# EAGLE design murdock_mcu_v2 (EAGLE 6.4)
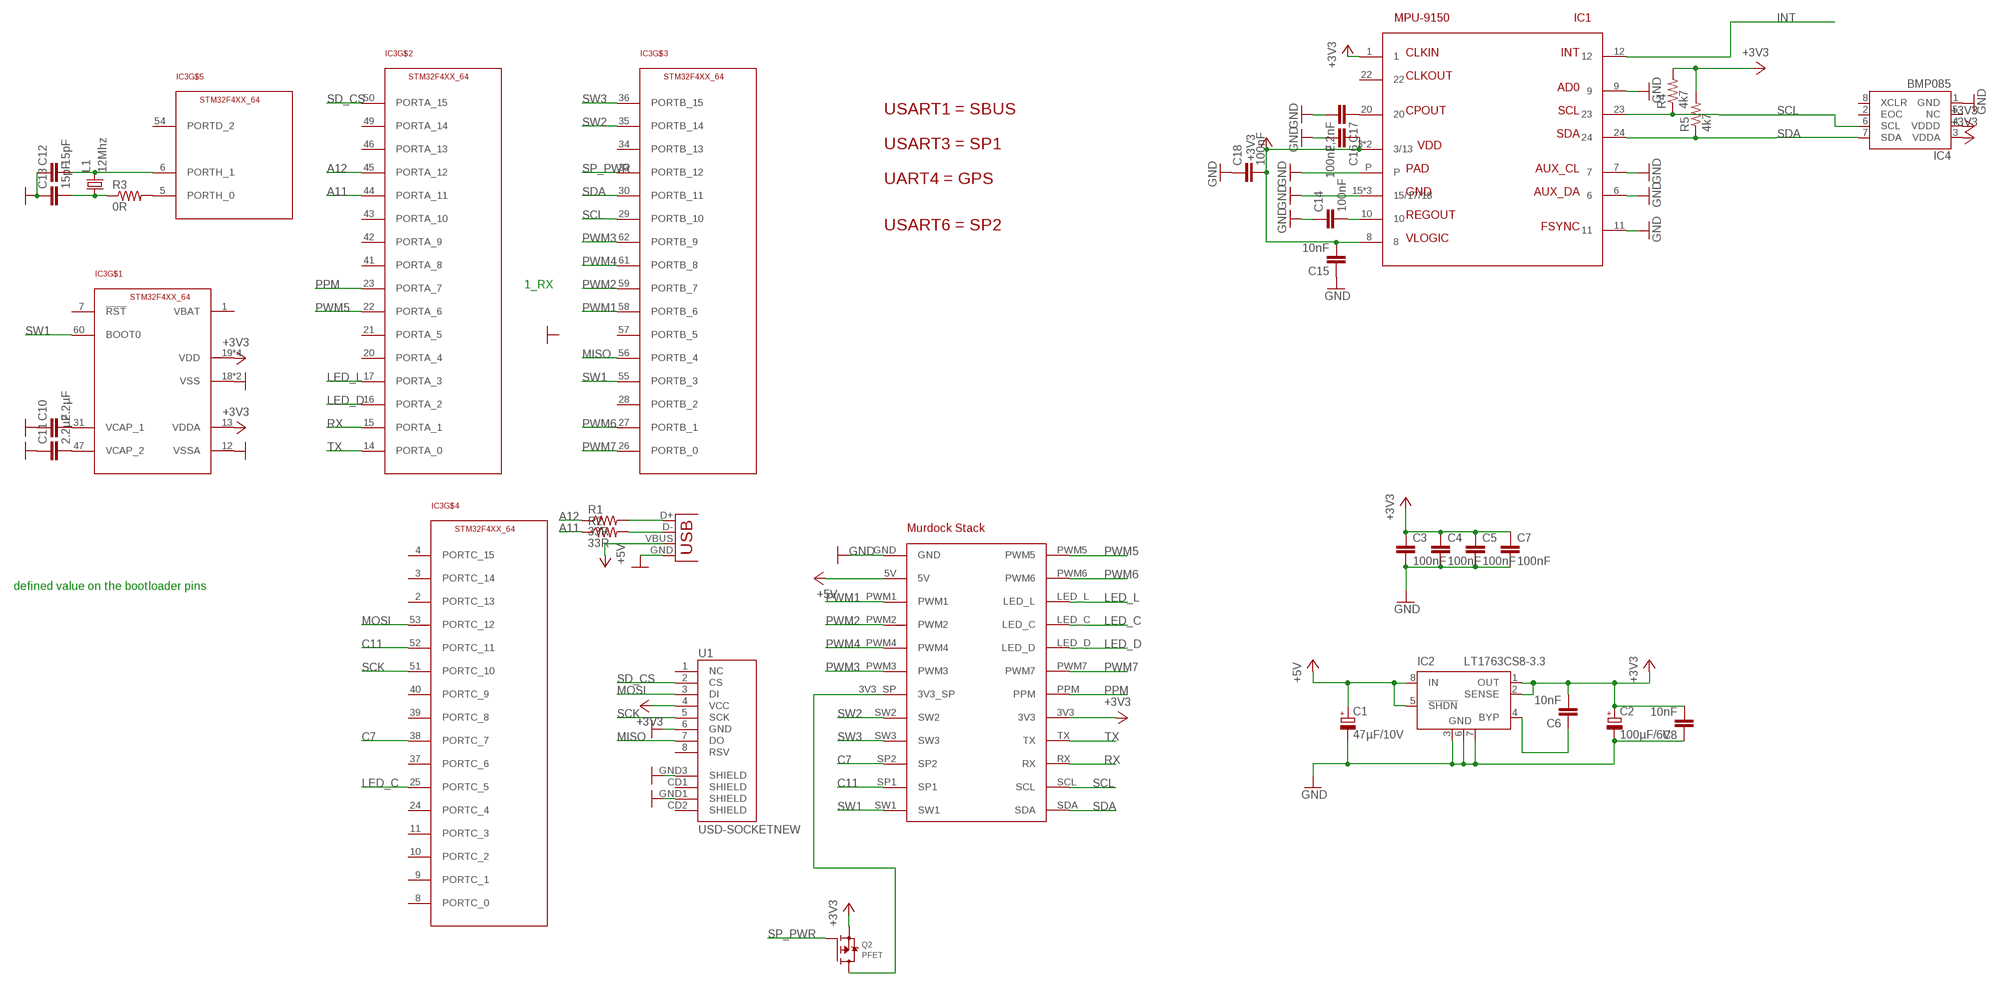
[diagram p0: schematic, sheet 1]

## Parts
C1  47µF/10V  CPOL-EUSMCD  [SMC_D]
C2  100µF/6V  CPOL-EUSMCD  [SMC_D]
C3  100nF  CAP0402-CAP  [0402-CAP]
C4  100nF  CAP0402-CAP  [0402-CAP]
C5  100nF  CAP0402-CAP  [0402-CAP]
C6  10nF  C-EUC0402  [C0402]
C7  100nF  CAP0402-CAP  [0402-CAP]
C8  10nF  C-EUC0402  [C0402]
C10  2.2µF  CAP0805  [0805]
C11  2.2µF  CAP0805  [0805]
C12  15pF  CAP0402-CAP  [0402-CAP]
C13  15pF  CAP0402-CAP  [0402-CAP]
C14  100nF  CAP0402-CAP  [0402-CAP]
C15  10nF  CAP0402-CAP  [0402-CAP]
C16  100nF  CAP0402-CAP  [0402-CAP]
C17  2,2nF  CAP0402-CAP  [0402-CAP]
C18  100nF  CAP0402-CAP  [0402-CAP]
IC1  MPU-9150  [QFN24]
IC2  LT1763CS8-3.3  [SOIC8]
IC3  STM32F4XX_64  [TQFP64]
IC4  BMP085  [BMP085]
L1  12Mhz  X22-OSCILLATOR  [X22]
Q2  PFET  MOSFET-P  [SOT23-R]
R1  33R  RESISTOR0402-RES  [0402-RES]
R2  33R  RESISTOR0402-RES  [0402-RES]
R3  0R  RESISTOR0402-RES  [0402-RES]
R4  4k7  RESISTOR0402-RES  [0402-RES]
R5  4k7  RESISTOR0402-RES  [0402-RES]
U1  USD-SOCKETNEW  [MICRO-SD-SOCKET-PP]
X1  USBSMD  [USB-MINIB]
X2  MURDOCK_STACK  [MURDOCK_STACK]

## Nets
+3V3: C2.+ C3.1 C4.1 C5.1 C6.2 C7.1 C8.2 C15.2 C16.1 C18.2 IC1.1 IC1.3(3/13) IC1.8 IC1.13(3/13) IC2.1(OUT) IC2.2(SENSE) IC3.13(VDDA) IC3.19(VDD) IC3.32(VDD) IC3.48(VDD) IC3.64(VDD) IC4.3(VDDA) IC4.4(VDDD) Q2.2(S) R4.2 R5.2 U1.4(VCC) X2.3V3
+5V: C1.+ IC2.5(!SHDN) IC2.8(IN) X1.VBUS X2.5V
A11: IC3.44(PORTA_11) R2.1
A12: IC3.45(PORTA_12) R1.1
C7: IC3.38(PORTC_7) X2.SP2
C11: IC3.52(PORTC_11) X2.SP1
GND: C1.- C2.- C3.2 C4.2 C5.2 C7.2 C8.1 C10.1 C11.1 C12.1 C13.1 C14.1 C15.1 C16.2 C17.2 C18.1 IC1.6 IC1.7 IC1.9 IC1.11 IC1.15(15/17/18) IC1.17(15/17/18) IC1.18(15/17/18) IC1.P IC2.3(GND) IC2.6(GND) IC2.7(GND) IC3.12(VSSA) IC3.18(VSS) IC3.63(VSS) IC4.1(GND) U1.6(GND) U1.GND1(SHIELD) U1.GND3(SHIELD) X1.GND X2.GND
INT: IC1.12
LED_C: IC3.25(PORTC_5) X2.LED_C
LED_D: IC3.16(PORTA_2) X2.LED_D
LED_L: IC3.17(PORTA_3) X2.LED_L
MISO: IC3.56(PORTB_4) U1.7(DO)
MOSI: IC3.53(PORTC_12) U1.3(DI)
N$1: R2.2 X1.D-
N$2: R1.2 X1.D+
N$3: C10.2 IC3.31(VCAP_1)
N$4: C11.2 IC3.47(VCAP_2)
N$5: IC3.5(PORTH_0) R3.2
N$6: C13.2 L1.1 R3.1
N$7: C12.2 IC3.6(PORTH_1) L1.3
N$8: Q2.3(D) X2.3V3_SP
N$9: C14.2 IC1.10
N$10: C17.1 IC1.20
N$13: C6.1 IC2.4(BYP)
PPM: IC3.23(PORTA_7) X2.PPM
PWM1: IC3.58(PORTB_6) X2.PWM1
PWM2: IC3.59(PORTB_7) X2.PWM2
PWM3: IC3.62(PORTB_9) X2.PWM3
PWM4: IC3.61(PORTB_8) X2.PWM4
PWM5: IC3.22(PORTA_6) X2.PWM5
PWM6: IC3.27(PORTB_1) X2.PWM6
PWM7: IC3.26(PORTB_0) X2.PWM7
RX: IC3.15(PORTA_1) X2.RX
SCK: IC3.51(PORTC_10) U1.5(SCK)
SCL: IC1.23 IC3.29(PORTB_10) IC4.6(SCL) R4.1 X2.SCL
SD_CS: IC3.50(PORTA_15) U1.2(CS)
SDA: IC1.24 IC3.30(PORTB_11) IC4.7(SDA) R5.1 X2.SDA
SP_PWR: IC3.33(PORTB_12) Q2.1(G)
SW1: IC3.55(PORTB_3) IC3.60(BOOT0) X2.SW1
SW2: IC3.35(PORTB_14) X2.SW2
SW3: IC3.36(PORTB_15) X2.SW3
TX: IC3.14(PORTA_0) X2.TX
Unconnected: IC1.22 IC3.1(VBAT) IC3.2(PORTC_13) IC3.3(PORTC_14) IC3.4(PORTC_15) IC3.7(!RST) IC3.8(PORTC_0) IC3.9(PORTC_1) IC3.10(PORTC_2) IC3.11(PORTC_3) IC3.20(PORTA_4) IC3.21(PORTA_5) IC3.24(PORTC_4) IC3.28(PORTB_2) IC3.34(PORTB_13) IC3.37(PORTC_6) IC3.39(PORTC_8) IC3.40(PORTC_9) IC3.41(PORTA_8) IC3.42(PORTA_9) IC3.43(PORTA_10) IC3.46(PORTA_13) IC3.49(PORTA_14) IC3.54(PORTD_2) IC3.57(PORTB_5) IC4.2(EOC) IC4.5(NC) IC4.8(XCLR) U1.1(NC) U1.8(RSV) U1.CD1(SHIELD) U1.CD2(SHIELD)

## Notes on the sheet
- USART1 = SBUS
- USART3 = SP1
- UART4 = GPS
- USART6 = SP2
- 1_RX
- defined value on the bootloader pins

## Library data of the parts
C1 C2 = rcl:CPOL-EU: POLARIZED CAPACITOR, European symbol
C3-C5 C7 C10-C13 = SparkFun-Capacitors:CAP: Capacitor Standard 0603 ceramic capacitor, and 0.1" leaded capacitor.
C6 C8 = rcl:C-EU: CAPACITOR, European symbol
C14-C18 = SparkFun:CAP: Capacitor Standard 0603 ceramic capacitor, and 0.1" leaded capacitor.
IC1 = seb:MPU-9150
IC2 = linear-technology:LT1763CS8: 500mA, Low Noise, LDO Micropower Regulators Source: http://cds.linear.com/docs/Datasheet/1763ff.pdf; MPN: LT1763CS8-3.3; OC_FARNELL: 1273617; OC_NEWARK: 57M6055
IC3 = stm32:STM32F4XX_64
IC4 = SparkFun-Sensors:BMP085: BMP085 Pressure Sensor Great little MEMS pressure sensor. SKU: COM-09603
L1 = seb:X22-OSCILLATOR
Q2 = microbuilder:MOSFET-P: P-Channel Mosfet LEGEND VDS: Voltage Drain-Source ID: Drain Current RDS(ON): Drain-Source On-State Resistance VGS(TH): Gate-Source Threshold Voltage CISS: Drain-Source Input Capacitance SOT-23 Name VDS ID RDS(ON) VGS(TH) CISS Order Number IRLML5103 30V 760mA 600 mOhm -- 75pF @ 25V Digikey: IRLML5103PBFCT-ND IRLML6401 12V 4.3A 50 mOhm 950mV @ 250µA 830pF @ 10V Digikey: IRLML6401PBFTR-ND NTR0202PL 20V 400mA 800 mOhm 2.3V @ 250uA 70pF @ 5V Digikey: NTR0202PLT1GOSTR-ND NTR4101PT1G 20V 1.8A 85 mOhm 1.2V @ 250uA 675pF @ 10V Digikey: NTR4101PT1GOSCT-ND DMP2004K 20V 600mA 900 mOhm 1V @ 250uA 175pF @ 16V Digikey: DMP2004KDICT-ND PMV65XP 20V 3.9A 76 mOhm 950mV @ 1mA 725pF @ 20V Digikey: 568-2358-2-ND TO-252 Name VDS ID RDS(ON) VGS(TH) CISS Order Number AOD417 30V 25A 34 mOhm 3V @ 250µA 920pF @ 15V Digikey: 785-1106-2-ND
R1-R3 = SparkFun-Resistors:RESISTOR: Resistor
R4 R5 = SparkFun:RESISTOR: Resistor
U1 = SparkFun-Connectors:USD-SOCKET: microSD Socket Push-push type uSD socket. Schematic element and footprint production proven. Spark Fun Electronics SKU : PRT-00127. tDoc lines correctly indicate media card edge positions when inserting (unlocked, locked, depressed).
X1 = SparkFun-Connectors:USB: USB Connectors USB-B-PTH is fully proven SKU : PRT-00139 USB-miniB is fully proven SKU : PRT-00587 USB-A-PCB is untested. USB-A-H is throughly reviewed, but untested. Spark Fun Electronics SKU : PRT-00437 USB-B-SMT is throughly reviewed, but untested. Needs silkscreen touching up. USB-A-S has not been used/tested USB-MB-H has not been used/tested
X2 = murdock:MURDOCK_STACK

## Board
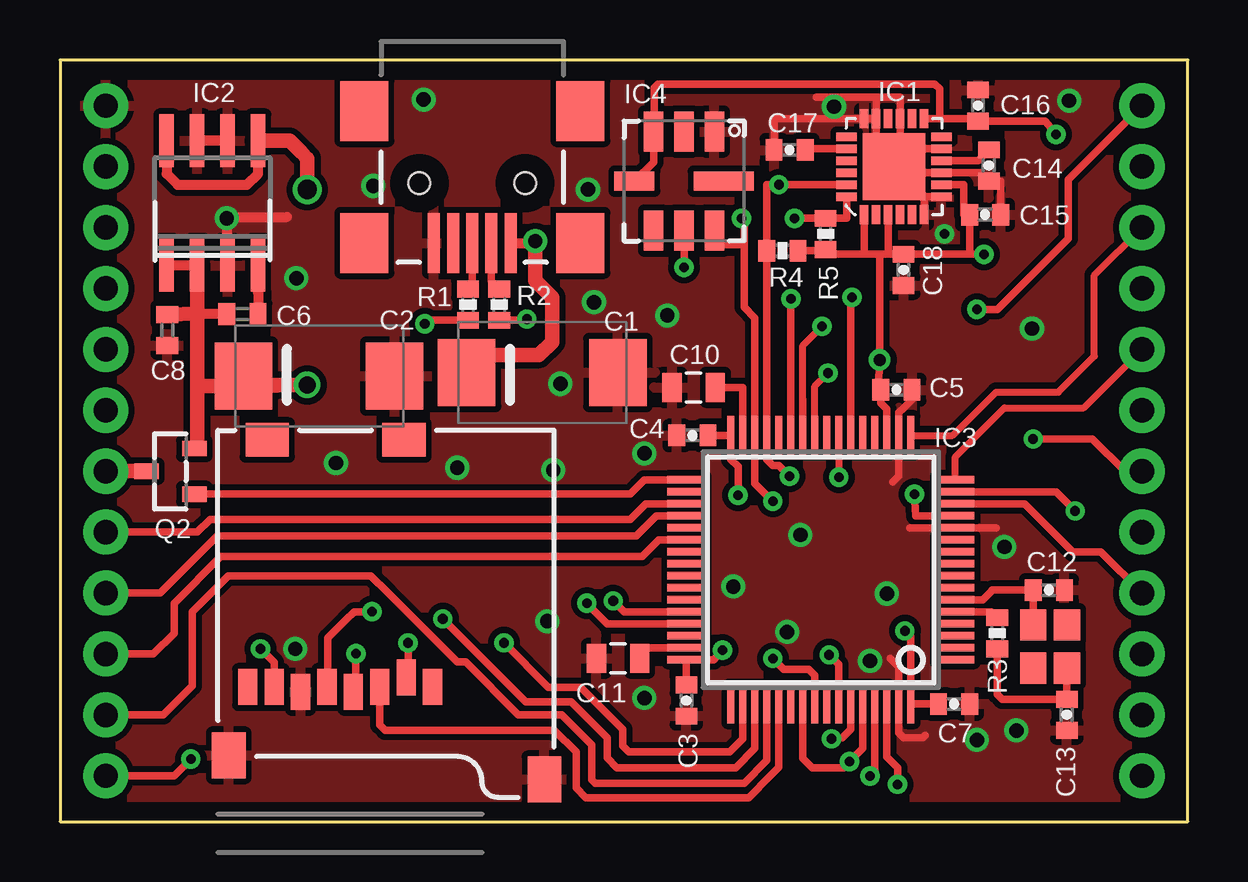
[diagram p1: board, top side]
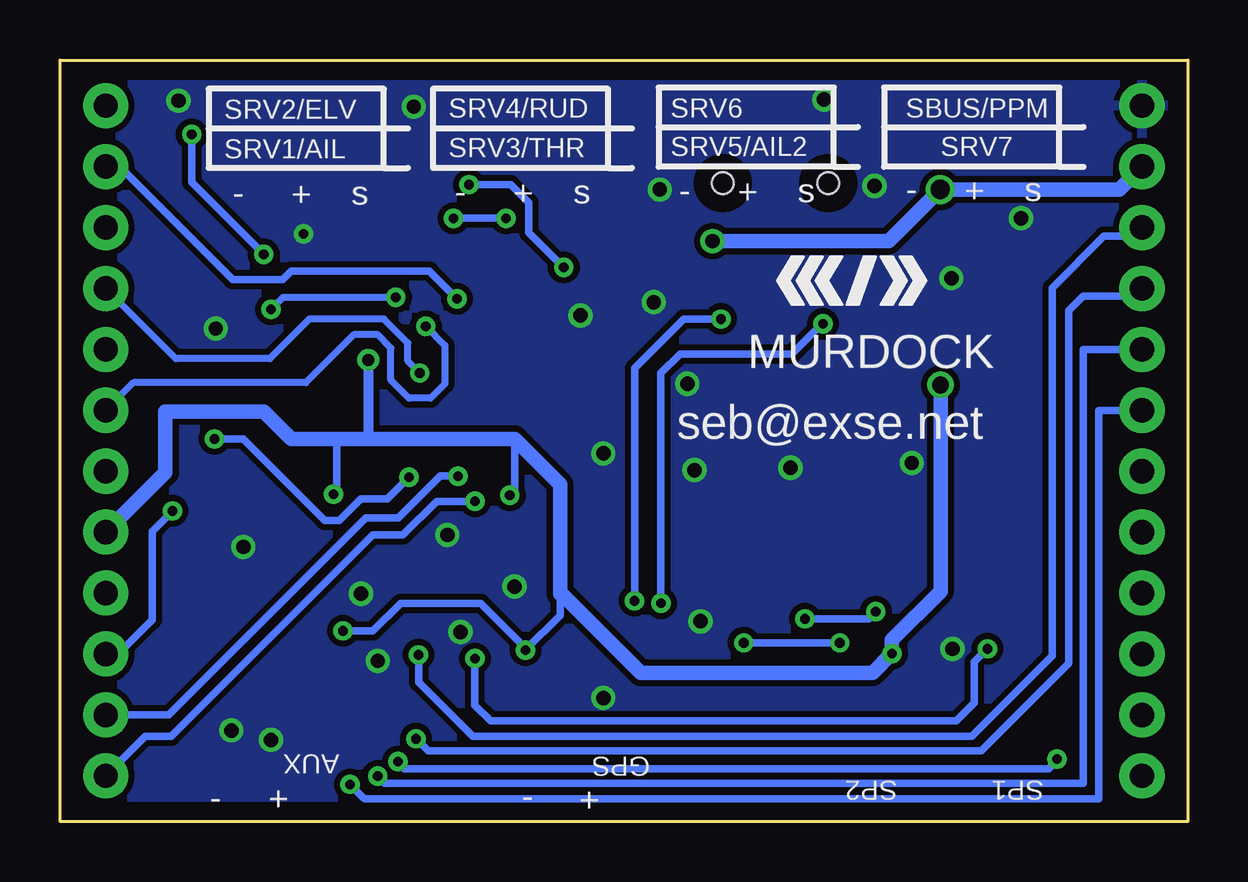
[diagram p2: board, bottom side, seen from below]

Size 46.99 x 31.75 mm. Coordinates in mm from the lower left corner, seen from the top.
Copper layers (1*16): Top 0.035mm / dielectric 1.5mm / Bottom 0.035mm
Design rules "default": minimum track width 10mil, minimum drill 0.4mm, track to track 8mil, track to pad 8mil, pad to pad 8mil, via to via 8mil, smd to smd 8mil, copper to edge 30mil, drill to drill 8mil, minimum pad ring 10mil, minimum via ring 8mil, stop-mask expansion 4mil, vias tented up to drill 1.5mm, thermal gap 10mil

### Footprints (pad centres in the part's own frame; a part is rotated, then mirrored left to right if it is on the bottom)
SMC_D = smd 2.4 x 2.8: + -3.15,0; - 3.15,0
0402-CAP = smd 0.7 x 0.9: 1 -0.65,0; 2 0.65,0
C0402 = smd 0.7 x 0.9: 1 -0.65,0; 2 0.65,0
0805 = smd 0.8 x 1.2: 1 -0.9,0; 2 0.9,0
QFN24 = smd 0.8 x 0.35: 1 -2,1.25; 2 -2,0.75; 3 -2,0.25; 4 -2,-0.25; 5 -2,-0.75; 6 -2,-1.25; 13 2,-1.25; 14 2,-0.75; 15 2,-0.25; 16 2,0.25; 17 2,0.75; 18 2,1.25 | smd 0.35 x 0.85: 7 -1.25,-1.975; 8 -0.75,-1.975; 9 -0.25,-1.975; 10 0.25,-1.975; 11 0.75,-1.975; 12 1.25,-1.975; 19 1.25,1.975; 20 0.75,1.975; 21 0.25,1.975; 22 -0.25,1.975; 23 -0.75,1.975; 24 -1.25,1.975 | smd 2.8 x 2.6: P 0,0
SOIC8 = smd 0.6 x 2.2: 1 -1.905,-2.6; 2 -0.635,-2.6; 3 0.635,-2.6; 4 1.905,-2.6; 5 1.905,2.6; 6 0.635,2.6; 7 -0.635,2.6; 8 -1.905,2.6
TQFP64 = smd 0.3 x 1.6: 1 -3.75,-5.6; 2 -3.25,-5.6; 3 -2.75,-5.6; 4 -2.25,-5.6; 5 -1.75,-5.6; 6 -1.25,-5.6; 7 -0.75,-5.6; 8 -0.25,-5.6; 9 0.25,-5.6; 10 0.75,-5.6; 11 1.25,-5.6; 12 1.75,-5.6; 13 2.25,-5.6; 14 2.75,-5.6; 15 3.25,-5.6; 16 3.75,-5.6; 33 3.75,5.6; 34 3.25,5.6; 35 2.75,5.6; 36 2.25,5.6; 37 1.75,5.6; 38 1.25,5.6; 39 0.75,5.6; 40 0.25,5.6; 41 -0.25,5.6; 42 -0.75,5.6; 43 -1.25,5.6; 44 -1.75,5.6; 45 -2.25,5.6; 46 -2.75,5.6; 47 -3.25,5.6; 48 -3.75,5.6 | smd 1.6 x 0.3: 17 5.6,-3.75; 18 5.6,-3.25; 19 5.6,-2.75; 20 5.6,-2.25; 21 5.6,-1.75; 22 5.6,-1.25; 23 5.6,-0.75; 24 5.6,-0.25; 25 5.6,0.25; 26 5.6,0.75; 27 5.6,1.25; 28 5.6,1.75; 29 5.6,2.25; 30 5.6,2.75; 31 5.6,3.25; 32 5.6,3.75; 49 -5.6,3.75; 50 -5.6,3.25; 51 -5.6,2.75; 52 -5.6,2.25; 53 -5.6,1.75; 54 -5.6,1.25; 55 -5.6,0.75; 56 -5.6,0.25; 57 -5.6,-0.25; 58 -5.6,-0.75; 59 -5.6,-1.25; 60 -5.6,-1.75; 61 -5.6,-2.25; 62 -5.6,-2.75; 63 -5.6,-3.25; 64 -5.6,-3.75
BMP085 = smd 1.67 x 0.8: 1 -2.065,1.27; 2 -2.065,0; 3 -2.065,-1.27; 5 2.065,-1.27; 6 2.065,0; 7 2.065,1.27 | smd 0.8 x 1.67: 4 0,-2.065 | smd 0.8 x 2.5: 8 0,1.65
X22 = smd 1.3 x 1.1: 1 0.9,0.7; 2 -0.9,0.7; 3 -0.9,-0.7; 4 0.9,-0.7
SOT23-R = smd 0.635 x 1.016: 1 -0.95,-1; 2 0.95,-1; 3 0,1
0402-RES = smd 0.7 x 0.9: 1 -0.65,0; 2 0.65,0
MICRO-SD-SOCKET-PP = smd 0.8 x 1.5: 1 -8.94,10.7; 2 -7.84,10.3; 3 -6.74,10.7; 4 -5.64,10.9; 5 -4.54,10.7; 6 -3.44,10.9; 7 -2.34,10.7; 8 -1.24,10.7 | smd 1.8 x 1.4: CD1 -2.05,0.4; CD2 -7.75,0.4 | smd 1.4 x 1.9: GND1 -13.6,14.55; GND3 -0.45,13.55
USB-MINIB = smd 2.5 x 0.5: D+ 2.5,0; D- 2.5,0.8; GND 2.5,-1.6; ID 2.5,-0.8; VBUS 2.5,1.6 | smd 2.5 x 2: MTN1 -3,4.5; MTN2 2.5,4.5; MTN3 -3,-4.5; MTN4 2.5,-4.5 | hole 0.9: 0,2.2; 0,-2.2
MURDOCK_STACK = drill 1.016 pad 1.88: 3V3 45.085,12.065; 3V3_SP 1.905,14.605; 5V 1.905,27.305; GND 1.905,29.845; LED_C 45.085,22.225; LED_D 45.085,19.685; LED_L 45.085,24.765; PPM 45.085,14.605; PWM1 1.905,24.765; PWM2 1.905,22.225; PWM3 1.905,17.145; PWM4 1.905,19.685; PWM5 45.085,29.845; PWM6 45.085,27.305; PWM7 45.085,17.145; RX 45.085,6.985; SCL 45.085,4.445; SDA 45.085,1.905; SP1 1.905,4.445; SP2 1.905,6.985; SW1 1.905,1.905; SW2 1.905,12.065; SW3 1.905,9.525; TX 45.085,9.525

### Placement (x,y rotation side)
C1  [SMC_D]  20.09,18.72 0 top
C2  [SMC_D]  10.79,18.57 0 top
C3  [0402-CAP]  26.1,5.05 270 top
C4  [0402-CAP]  26.35,16.1 180 top
C5  [0402-CAP]  34.85,18 0 top
C6  7.6,21.16 180 top
C7  [0402-CAP]  37.25,4.9 0 top
C8  4.47,20.49 90 top
C10  [0805]  26.4,18.1 0 top
C11  [0805]  23.25,6.8 0 top
C12  [0402-CAP]  41.2,9.65 180 top
C13  [0402-CAP]  41.95,4.45 90 top
C14  38.7,27.35 90 top
C15  38.55,25.3 180 top
C16  38.25,29.85 90 top
C17  30.4,28 180 top
C18  35.15,23 90 top
IC1  34.75,27.3 90 top
IC2  6.35,25.79 0 top
IC3  31.7,10.5 90 top
IC4  26,26.7 270 top
L1  [X22]  41.25,7.3 270 top
Q2  [SOT23-R]  4.6,14.6 90 top
R1  [0402-RES]  17,21.55 90 top
R2  [0402-RES]  18.3,21.55 90 top
R3  [0402-RES]  39.05,7.85 90 top
R4  [0402-RES]  30.1,23.8 0 top
R5  [0402-RES]  31.9,24.5 270 top
U1  6.58,16.31 180 top
U$1  [C3D2_LOGO_SMALL]  17.1,22.55 0 bottom
X1  17.18,26.62 270 top
X2  0,0 0 top

### Tracks (layer width: path | path; a pad name or v marks a point on that pad's centre or on a via)
+3V3  (via drill 0.4, 0.5, 0.7)
  Top 0.305: IC3.19 34.45,17.2 34.3,17.35 34.2,17.45 | 34.2,17.45 C5.1 | C3.1 IC3.48 27.25,6.75 v27.6,7.15 | C4.1 IC3.32 27.95,15.1 28.25,14.8 v28.25,13.6 | 34.2,17.45 C5.1 | C5.1 34.1,18.1 v34.15,19.25 34.15,23.6 34.1,23.65 | C7.1 IC3.64 35.45,7.7 v35.2,7.95 | IC3.13 35.65,12.75 v35.6,13.65 | 12.28,5.47 U1.4 12.33,5.52 v12.33,7 | IC1.13 36.65,29.3 | 36.65,29.3 38.25,29.3 C16.1 41.05,29.2 v41.5,28.65 | IC1.8 37.65,26.55 37.65,26.15 37.65,25.3 C15.2 37.9,23.65 | 37.9,23.65 C18.2 34.5,23.65 | IC1.3 34.5,23.65 | 33.5,23.65 31.75,23.65 R5.2 31.85,23.8 R4.2 | 33.5,23.65 34.1,23.65 | 34.1,23.65 34.5,23.65 | IC1.1 33.5,23.65 | v38.5,23.65 37.9,23.65 | IC4.4 24.73,27.5 IC4.3 24.75,28.79 24.75,30.6 24.9,30.75 36.45,30.75 36.65,30.55 36.65,29.3
  Top 0.406: C6.2 5.76,21.16 5.71,21.17 IC2.2 IC2.1
  Top 0.61: 5.71,21.17 5.71,18.27 5.71,21.17 | 5.71,21.17 IC2.2 | C8.2 5.71,21.17 | 5.71,18.16 5.71,21.17 | 5.71,18.16 7.95,18.16 v10.3,18.2 8,18.2 7.67,18.17 C2.+ | Q2.2 5.71,15.66 5.71,18.16
  Bottom 0.305: 26.15,9.5 26.15,8.6 v27.6,7.15 27.6,7.25 29.45,9.1 32.8,9.1 33.95,7.95 v35.2,7.95 | 28.05,15.95 28.05,13.8 v28.25,13.6 | v35.6,13.65 35.45,14.05 35.45,15.95 | v38.5,23.65 41.5,26.65 v41.5,28.65
  Bottom 0.406: v34.15,19.25 34.15,16.05 34.05,15.95
  Bottom 0.61: 26.15,9.5 26.15,9.85 | 26.15,9.85 26.15,14.05 28.05,15.95 34.05,15.95 35.45,15.95 37.35,15.95 38.35,16.95 38.5,17.1 42.6,17.1 42.6,14.55 X2.3V3 | 26.15,9.85 26.15,9.55 22.8,6.2 13.13,6.2 v12.33,7 12.33,7.57 10.3,9.6 10.3,12 v10.3,18.2
+5V  (via drill 0.6, 0.8)
  Top 0.406: IC2.8 4.45,27 4.9,26.55 7.8,26.55 8.25,27 8.25,27.23 IC2.5 | X1.VBUS 19.57,24.12 v19.8,24.2
  Top 0.61: IC2.5 9.56,28.39 10.05,27.9 10.31,27.64 v10.31,26.35 | C1.+ 17.67,19.45 19.95,19.45 20.5,20 20.5,21.85 19.8,22.55 v19.8,24.2
  Bottom 0.61: X2.5V 2.86,26.35 v10.31,26.35 12.46,24.2 v19.8,24.2
A11  (via drill 0.4)
  Top 0.305: IC3.44 23.5,8.75 v23.05,9.2 | R2.1 19.4,20.9 v19.45,20.95
  Bottom 0.305: v23.05,9.2 23.05,18.9 21,20.95 v19.45,20.95
A12  (via drill 0.4)
  Top 0.305: IC3.45 22.8,8.25 v21.95,9.1 | R1.1 15.35,20.9 v15.2,20.75
  Bottom 0.305: v21.95,9.1 21.95,18.7 21.15,19.5 16.5,19.5 15.25,20.75 v15.2,20.75
C7
  Top 0.305: IC3.38 24.95,11.75 24.7,11.5 24.25,11.05 20.3,11.05 6.7,11.05 4.75,9.1 4.75,7.85 3.88,6.99 X2.SP2
C11
  Top 0.305: X2.SP1 4.29,4.45 5.35,5.5 5.5,5.65 5.5,8.75 7,10.25 12.95,10.25 13.65,9.55 16.55,6.65 16.9,6.65 19.1,4.45 20.9,4.45 22.15,3.2 22.15,1.75 22.3,1.6 28.5,1.6 29.45,2.55 IC3.52
GND  (via drill 0.4, 0.6)
  Top 0.305: 34.7,14.15 34.95,14.4 IC3.18 34.95,17.05 35.15,17.25 35.5,17.6 C5.2 | IC3.12 37.1,12.25 | 37.1,12.25 35.4,12.25 | 34.6,6.8 34.95,6.45 IC3.63 34.95,3.7 35.15,3.5 35.95,3.5 36.05,3.6 | 39,12.25 37.1,12.25 | IC1.11 35.8,28.05 35.6,27.85 | 35.6,27.85 35.6,27.3 | 35.6,27.3 35.75,27.15 35.85,27.05 IC1.9 38.35,27.05 C14.1 39.2,26.7 C15.1 | IC1.7 36,26.05 | 36,26.05 35.85,26.05 35.6,26.3 35.6,27.3 | IC1.6 36,26.05 | IC1.15 35,29 | 35,29 35,28.05 | 35,28.05 35,27.85 | 35,27.85 35.6,27.85 | 34,29.05 IC1.17 IC1.18 29.75,29.3 C17.2 | 34,29.05 34,28.05 35,28.05 | 35,27.85 35,27.3 IC1.P | 34,29.05 34,30.2 33.7,30.2 | 33.7,30.2 31.5,30.2 | 35,29 35,30.2 33.7,30.2
  Top 0.406: IC2.6 IC2.7 | IC2.3 6.99,23.84 6.95,25.2 9.45,25.2
  other vias: 20.85,18.25 30.85,11.95 40.5,20.55 42.05,30.05 11.5,14.95 16.55,14.75 28.05,9.8 38.2,3.4 39.85,3.8 39.35,11.45 34.45,9.5 20.3,8.35 24.35,15.35 20.55,14.65 22.25,21.65 15.15,30.1 13.05,26.5 6.95,25.15 9.8,7.2 24.35,5.15 30.3,7.9 33.75,6.7 32.25,29.8 36.85,24.5 25.3,21.1 9.85,22.65 22,26.35
  pour Top (isolate 0.254): 46.99,0 46.99,33.02 -0.95,33.02 -0.95,0
  pour Bottom (isolate 0.254): 46.99,0 46.99,33.02 -0.95,33.02 -0.95,0
LED_C  (via drill 0.4)
  Top 0.3: IC3.25 31.45,18.15 v32,18.7
  Bottom 0.3: v32,18.7 32,18.75 v32,18.7 | X2.LED_C 42.16,19.3 38.25,19.3 36.6,20.95 33.5,20.95 32.5,19.95 32.5,19.2 v32,18.7
LED_D
  Top 0.3: IC3.16 37.3,15.2 39.35,17.25 42.65,17.25 X2.LED_D
LED_L
  Top 0.3: IC3.17 37.2,16.1 39,17.9 41.6,17.9 43.1,19.4 43.1,22.78 X2.LED_L
MISO  (via drill 0.4)
  Top 0.305: v8.35,7.2 8.92,6.63 U1.7 | IC3.56 31.45,6.1 31.2,6.35 30.15,6.35 v29.7,6.8
  Bottom 0.305: v29.7,6.8 29.7,4.85 29.05,4.2 9.65,4.2 8.9,4.95 8.9,6.65 v8.35,7.2
MOSI
  Top 0.305: IC3.53 29.95,2.25 29.6,1.9 28.7,1 21.9,1 21.5,1.4 21.5,2.9 20.6,3.8 17.3,3.8 16.45,3.8 14.3,3.8 13.55,3.8 13.32,4.03 U1.3
N$1
  Top 0.305: X1.D- 17.98,22.52 R2.2
N$2
  Top 0.305: X1.D+ 17.18,22.38 R1.2
N$3
  Top 0.305: IC3.31 28.45,18.1 C10.2
N$4
  Top 0.305: IC3.47 25.25,7.25 24.2,7.25 C11.2
N$5
  Top 0.305: IC3.5 38.8,8.75 R3.2
N$6
  Top 0.305: R3.1 39.05,5.3 39.25,5.1 C13.2 L1.1
N$7
  Top 0.305: L1.3 C12.2 38.85,9.65 38.8,9.6 38.45,9.25 IC3.6
N$8
  Top 0.61: Q2.3 X2.3V3_SP
N$9
  Top 0.305: IC1.10 38.25,27.55 C14.2
N$10
  Top 0.305: IC1.20 31.05,28.05 C17.1
N$13
  Top 0.406: IC2.4 8.25,22.04 C6.1
PPM  (via drill 0.4)
  Top 0.3: IC3.23 v32.45,14.35
  Top 0.305: X2.PPM 44.35,14.61 43.01,15.95 v40.55,15.95
  Bottom 0.305: v32.45,14.35 33.35,13.45 34.45,13.45 35.35,12.55 35.95,12.55 38.5,15.1 39.35,15.95 v40.55,15.95
PWM1  (via drill 0.4)
  Top 0.305: IC3.58 32.45,6.55 v32.05,6.95
  Bottom 0.305: v32.05,6.95 32.05,5.8 29.8,3.55 9,3.55 5.65,6.9 5.65,22.25 3.5,24.4 2.27,24.4 X2.PWM1
PWM2  (via drill 0.4)
  Top 0.305: IC3.59 32.95,3.85 32.6,3.5 32.2,3.5 v32.15,3.45
  Bottom 0.305: v32.15,3.45 31.65,2.95 8.6,2.95 4.95,6.6 4.95,21.3 4.35,21.9 2.23,21.9 X2.PWM2
PWM3  (via drill 0.4)
  Top 0.305: v34.9,1.55 34.9,2.25 34.45,2.7 IC3.62
  Bottom 0.305: X2.PWM3 3.7,17.14 3.7,0.95 34.3,0.95 34.35,1 v34.9,1.55
PWM4  (via drill 0.4)
  Top 0.305: v33.75,1.9 33.95,2.1 IC3.61
  Bottom 0.305: X2.PWM4 4.35,19.68 4.35,1.6 33.35,1.6 33.45,1.6 v33.75,1.9
PWM5  (via drill 0.4)
  Top 0.305: IC3.22 32.95,18.05 32.95,21.8 v33,21.85 | X2.PWM5 42,26.76 42,24.3 39.05,21.35 v38.2,21.35
  Bottom 0.3: v33,21.85 37.7,21.85 v38.2,21.35
PWM6  (via drill 0.4)
  Top 0.305: v30.45,21.8 IC3.27
  Bottom 0.305: v30.45,21.8 31.61,22.95 37.35,22.95 37.7,22.6 39.8,22.6 44.51,27.3 X2.PWM6
PWM7  (via drill 0.4)
  Top 0.3: 30.95,17.6 30.95,19.85 v31.75,20.65
  Top 0.305: 30.95,17.6 IC3.26
  Bottom 0.3: v31.75,20.65 30.95,19.85 30.95,18.25 31.55,17.65 32.45,17.65 33.2,18.4 33.2,19.75 33.75,20.3 34.75,20.3 36.75,18.3 43.93,18.3 X2.PWM7
RX  (via drill 0.4)
  Top 0.305: IC3.15 41.5,13.75 v42.3,12.95
  Bottom 0.305: X2.RX 44.56,6.99 43.15,8.4 43.15,12.1 v42.3,12.95
SCK  (via drill 0.4)
  Top 0.305: U1.5 11.15,5.64 11.15,7.15 11.15,7.65 11.9,8.4 12.25,8.75 v13,8.75 | IC3.51 28.95,3.05 28.15,2.25 23.2,2.25 22.8,2.65 22.8,3.5 21.3,5 19.4,5 v15.95,8.45
  Bottom 0.305: v15.95,8.45 13.3,8.45 v13,8.75
SCL  (via drill 0.4)
  Top 0.305: v30.4,14.4 29.95,14.85 29.7,14.85 29.45,15.1 IC3.29 29.45,22.2 R4.1 29.45,26.55 v29.95,26.55 | v29.95,26.55 30.45,26.55 | 30.45,26.55 IC1.23 | IC4.6 v26,23.1 | v29.95,26.55 30.45,26.55
  Bottom 0.305: v30.4,14.4 31.15,14.4 31.9,13.65 32.9,12.65 34.25,12.65 42.45,4.45 X2.SCL | v26,23.1 27.45,24.55 27.45,25.8 28.2,26.55 v29.95,26.55
SD_CS  (via drill 0.4)
  Top 0.305: 14.45,6.04 U1.2 14.5,6.09 v14.5,7.45 | IC3.50 28.45,3.45 27.9,2.9 23.7,2.9 23.45,3.15 23.45,3.85 21.7,5.6 20.35,5.6 v18.5,7.45
  Bottom 0.305: v18.5,7.45 15.05,7.45 v14.5,7.45
SDA  (via drill 0.4)
  Top 0.305: v29.7,13.35 28.95,14.1 IC3.30 28.95,21 28.5,21.45 28.5,24.05 | IC1.24 32.77,25.15 R5.1 v30.6,25.15 | 28.5,24.05 28.5,25.05 v28.4,25.15 | IC4.7 27.45,24.05 28.5,24.05
  Bottom 0.305: v29.7,13.35 31.3,13.35 32.7,11.95 33.95,11.95 42.35,3.55 43.44,3.55 X2.SDA | v28.4,25.15 v30.6,25.15
SP_PWR
  Top 0.305: Q2.1 23.75,13.65 24.1,14 24.35,14.25 IC3.33
SW1  (via drill 0.4)
  Top 0.305: IC3.60 33.45,3.05 v32.9,2.5 32.65,2.25 31.35,2.25 30.95,2.64 IC3.55 | X2.SW1 4.75,1.91 v5.45,2.6
  Bottom 0.305: v5.45,2.6 5.45,2.55 5.8,2.2 32.65,2.2 v32.9,2.5
SW2
  Top 0.305: X2.SW2 5.71,12.06 6.25,12.6 23.75,12.6 24.25,13.1 24.4,13.25 IC3.35
SW3
  Top 0.305: X2.SW3 4.17,9.53 6.55,11.9 24,11.9 24.5,12.4 24.85,12.75 IC3.36
TX
  Top 0.305: IC3.14 40.2,13.25 41.2,12.25 42.2,11.25 43.36,11.25 X2.TX

### Text on the board
bPlace: SBUS/PPM | SRV6 | SRV4/RUD | SRV2/ELV | SRV7 | SRV5/AIL2 | SRV3/THR | SRV1/AIL | s | + | - | s | + | - | s | + | - | s | + | - | MURDOCK | seb@exse.net | GPS | AUX | SP1 | SP2 | - | + | + | -
tNames: IC4